# Altium project ES6339.PrjPcb
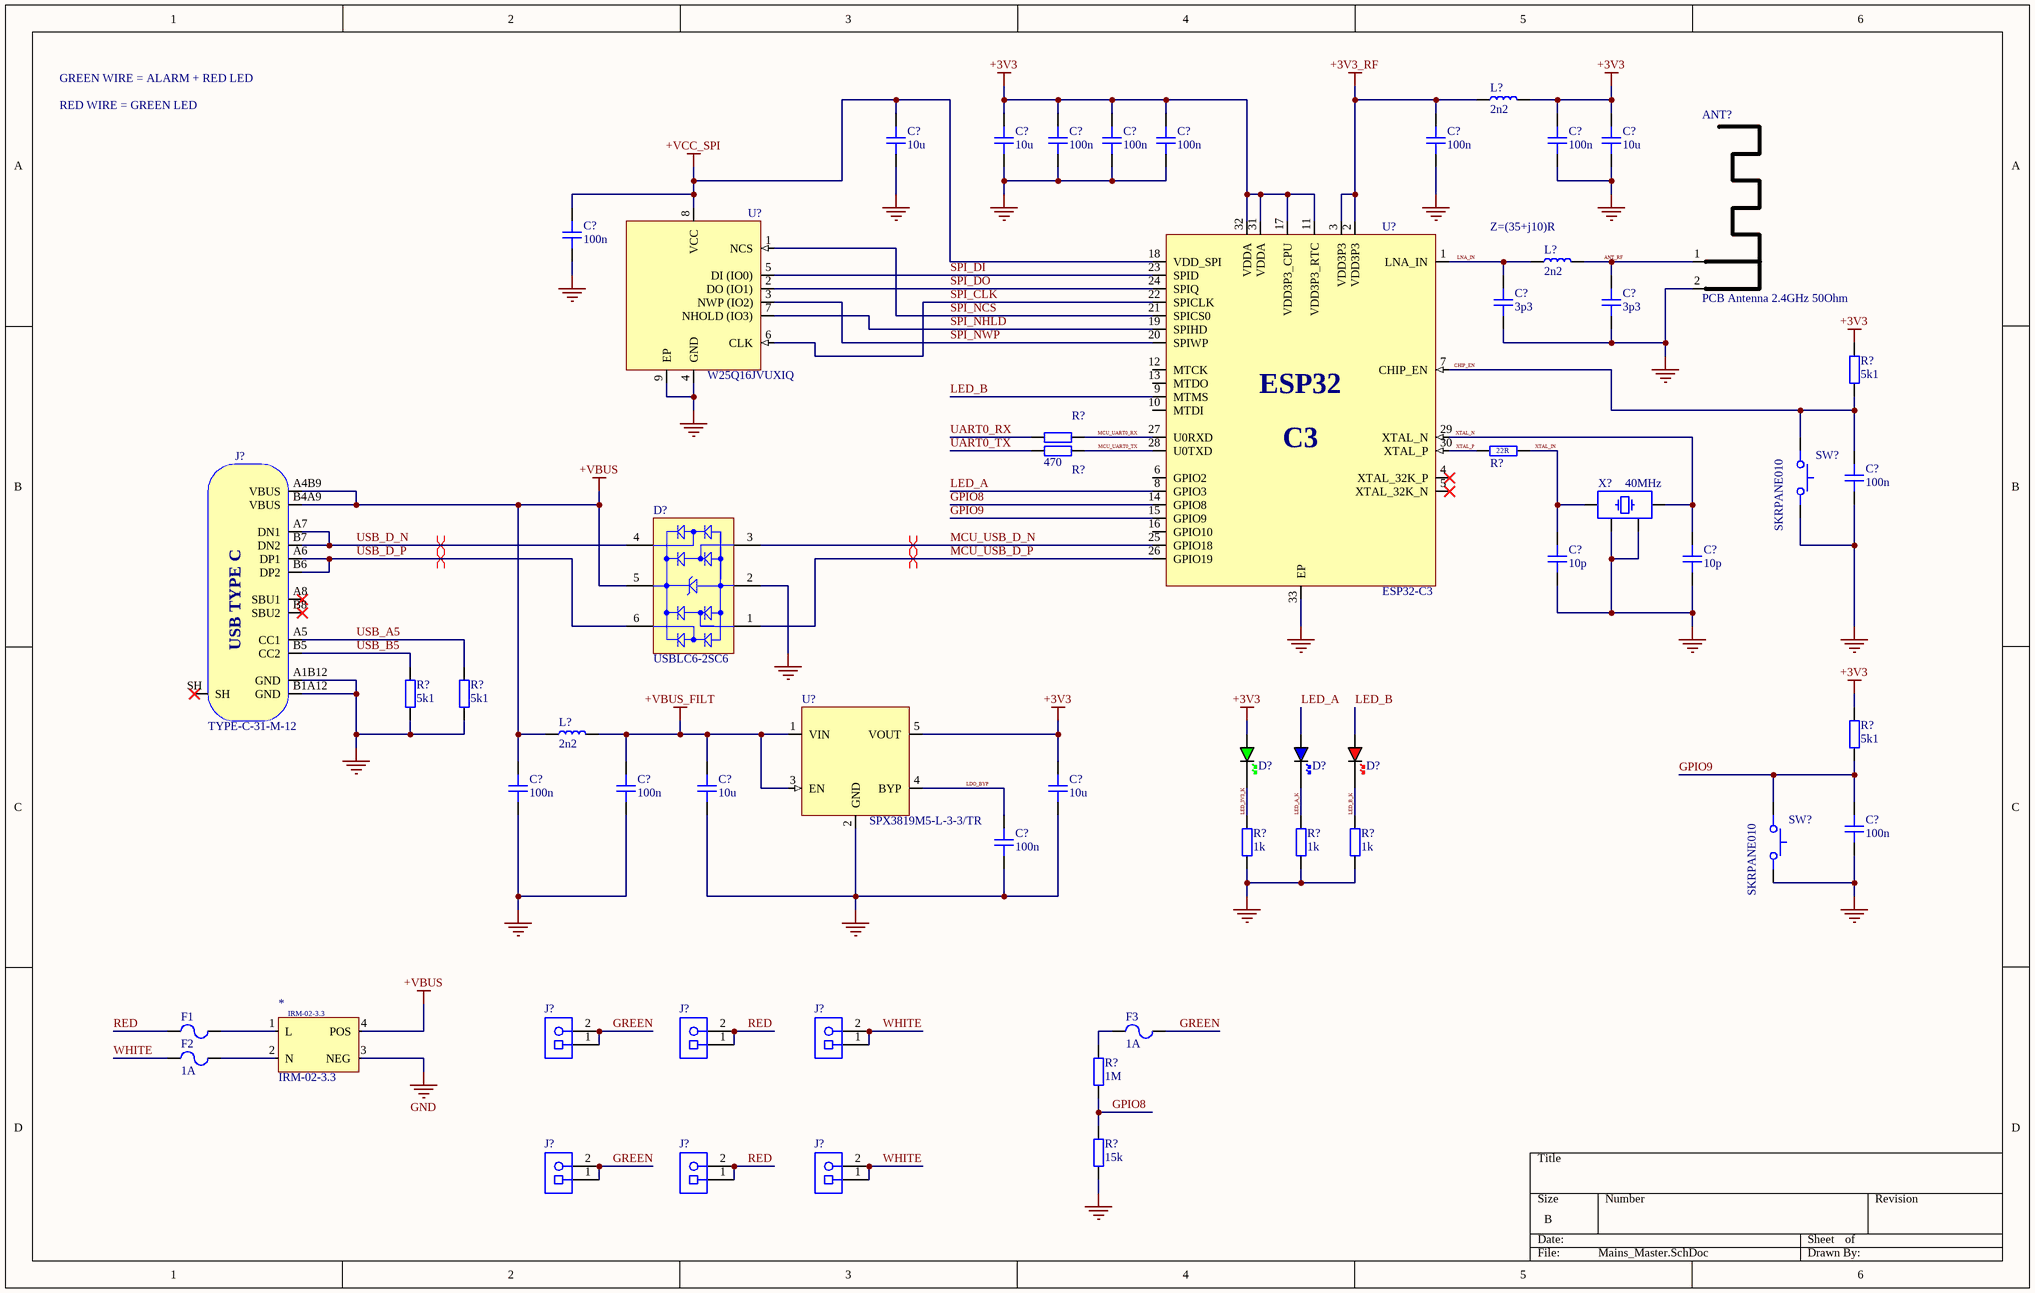
[diagram p0: Mains_Master.SchDoc]
2 sheets, 130 parts. Net scope: global (net labels, ports and power ports of the same name join across sheets).
Sheets:
  Mains_Master.SchDoc
  Door_Receiver.SchDoc

## Sheet Mains_Master.SchDoc
size B; SheetNumber: 1; SheetTotal: 2

### Parts
(Parts that share a designator on the sheet are numbered #1, #2 ... from top to bottom, then left to right.)
*  IRM-02-3.3  [IRM-02-3.3]
ANT?#1  PCB Antenna 2.4GHz 50Ohm  [ANT_IFA_USB_2_4GHZ_50R]  (no BOM)
C?#1  10u  [CAP_0603]
C?#2  10u  [CAP_0603]
C?#3  100n  [CAP_0805]
C?#4  100n  [CAP_0805]
C?#5  100n  [CAP_0805]
C?#6  100n  [CAP_0805]
C?#7  100n  [CAP_0805]
C?#8  10u  [CAP_0603]
C?#9  100n  [CAP_0805]
C?#10  3p3  [CAP_0402]
C?#11  3p3  [CAP_0402]
C?#12  100n  [CAP_0805]
C?#13  10p  [CAP_0402]
C?#14  10p  [CAP_0402]
C?#15  100n  [CAP_0805]
C?#16  100n  [CAP_0805]
C?#17  10u  [CAP_0603]
C?#18  10u  [CAP_0603]
C?#19  100n  [CAP_0805]
C?#20  100n  [CAP_0805]
D?#1  USBLC6-2SC6  [STM-SOT23-6L_V]
D?#2  GREEN  [LED_0603_GREEN]  (value not drawn)
D?#3  BLUE  [LED_0603_BLUE]  (value not drawn)
D?#4  RED  [LED_0603_RED]  (value not drawn)
F1  1A  [FUSE_6125N]  (value not drawn)
F2  1A  [FUSE_6125N]
F3  1A  [FUSE_6125N]
J?#1  TYPE-C-31-M-12  [TYPE-C-31-M-12]
J?#2  1729128  [PHOE-1729128-2_V]  (value not drawn)
J?#3  1729128  [PHOE-1729128-2_V]  (value not drawn)
J?#4  1729128  [PHOE-1729128-2_V]  (value not drawn)
J?#5  1729128  [PHOE-1729128-2_V]  (value not drawn)
J?#6  1729128  [PHOE-1729128-2_V]  (value not drawn)
J?#7  1729128  [PHOE-1729128-2_V]  (value not drawn)
L?#1  2n2  [IND_0402]
L?#2  2n2  [IND_0402]
L?#3  2n2  [IND_0402]
R?#1  5k1  [RES_0805]
R?#2  470  [RES_0805]  (value not drawn)
R?#3  470  [RES_0805]
R?#4  22R  [RES_0402]
R?#5  5k1  [RES_0805]
R?#6  5k1  [RES_0805]
R?#7  5k1  [RES_0805]
R?#8  1k  [RES_0805]
R?#9  1k  [RES_0805]
R?#10  1k  [RES_0805]
R?#11  1M  [RES_0805]
R?#12  15k  [RES_0805]
SW?#1  SKRPANE010  [SKRPANE010]
SW?#2  SKRPANE010  [SKRPANE010]
U?#1  W25Q16JVUXIQ  [USON-8-2X3MM]
U?#2  ESP32-C3  [QFN32-5x5]
U?#3  SPX3819M5-L-3-3/TR  [SOT-23-5]
X?#1  40MHz  [XTAL_2520]

### Nets
+3V3: C?#2.2 C?#3.2 C?#4.2 C?#5.2 C?#7.2 C?#8.2 C?#18.2 D?#2.A L?#1.1 R?#1.2 R?#7.2 U?#2.11(VDD3P3_RTC) U?#2.17(VDD3P3_CPU) U?#2.31(VDDA) U?#2.32(VDDA) U?#3.5(VOUT)
+3V3_RF: C?#6.2 L?#1.2 U?#2.2(VDD3P3) U?#2.3(VDD3P3)
+VBUS: *.4(POS) C?#15.2 D?#1.5(VBUS) J?#1.A4B9(VBUS) J?#1.B4A9(VBUS) L?#3.2
+VBUS_FILT: C?#16.2 C?#17.2 L?#3.1 U?#3.1(VIN) U?#3.3(EN)
+VCC_SPI: C?#1.2 C?#9.2 U?#1.8(VCC) U?#2.18(VDD_SPI)
GND: *.3(NEG) ANT?#1.2(GND) C?#1.1 C?#2.1 C?#3.1 C?#4.1 C?#5.1 C?#6.1 C?#7.1 C?#8.1 C?#9.1 C?#10.1 C?#11.1 C?#12.1 C?#13.1 C?#14.1 C?#15.1 C?#16.1 C?#17.1 C?#18.1 C?#19.1 C?#20.1 D?#1.2(GND) J?#1.A1B12(GND) J?#1.B1A12(GND) R?#5.1 R?#6.1 R?#8.1 R?#9.1 R?#10.1 R?#12.1 SW?#1.12 SW?#2.12 U?#1.4(GND) U?#1.9(EP) U?#2.33(EP) U?#3.2(GND) X?#1.2 X?#1.4
ANT_RF: ANT?#1.1(RF) C?#11.2 L?#2.1
CHIP_EN: C?#12.2 R?#1.1 SW?#1.34 U?#2.7(CHIP_EN)
GPIO8: R?#11.1 R?#12.2 U?#2.14(GPIO8)
GPIO9: C?#19.2 R?#7.1 SW?#2.34 U?#2.15(GPIO9)
GREEN: F3.2 J?#2.1 J?#2.2 J?#5.1 J?#5.2
LDO_BYP: C?#20.2 U?#3.4(BYP)
LED_3V3_K: D?#2.K R?#8.2
LED_A: D?#3.A U?#2.8(GPIO3)
LED_A_K: D?#3.K R?#9.2
LED_B: D?#4.A U?#2.9(MTMS)
LED_B_K: D?#4.K R?#10.2
LNA_IN: C?#10.2 L?#2.2 U?#2.1(LNA_IN)
MCU_UART0_RX: R?#2.1 U?#2.27(U0RXD)
MCU_UART0_TX: R?#3.1 U?#2.28(U0TXD)
MCU_USB_D_N: D?#1.3(I/O_2) U?#2.25(GPIO18)
MCU_USB_D_P: D?#1.1(I/O_1) U?#2.26(GPIO19)
RED: F1.1 J?#3.1 J?#3.2 J?#6.1 J?#6.2
SPI_CLK: U?#1.6(CLK) U?#2.22(SPICLK)
SPI_DI: U?#1.5(DI_(IO0)) U?#2.23(SPID)
SPI_DO: U?#1.2(DO_(IO1)) U?#2.24(SPIQ)
SPI_NCS: U?#1.1(NCS) U?#2.21(SPICS0)
SPI_NHLD: U?#1.7(NHOLD_(IO3)) U?#2.19(SPIHD)
SPI_NWP: U?#1.3(NWP_(IO2)) U?#2.20(SPIWP)
UART0_RX: R?#2.2
UART0_TX: R?#3.2
USB_A5: J?#1.A5(CC1) R?#6.2
USB_B5: J?#1.B5(CC2) R?#5.2
USB_D_N: D?#1.4(I/O_3) J?#1.A7(DN1) J?#1.B7(DN2)
USB_D_P: D?#1.6(I/O_4) J?#1.A6(DP1) J?#1.B6(DP2)
WHITE: F2.1 J?#4.1 J?#4.2 J?#7.1 J?#7.2
XTAL_IN: C?#13.2 R?#4.2 X?#1.3
XTAL_N: C?#14.2 U?#2.29(XTAL_N) X?#1.1
XTAL_P: R?#4.1 U?#2.30(XTAL_P)
Net*_1: *.1(L) F1.2
Net*_2: *.2(N) F2.2
NetF3_1: F3.1 R?#11.2

Not connected (* = marked no-connect by the designer): J?#1 A8(SBU1)* B8(SBU2)* SH*; U?#2 4(XTAL_32K_P)* 5(XTAL_32K_N)* 6(GPIO2) 10(MTDI) 12(MTCK) 13(MTDO) 16(GPIO10)

### Layout directives
differential pair; differential pair class DIFF_USB: MCU_USB_D_N, MCU_USB_D_P, USB_D_N, USB_D_P

### Notes on the sheet
- GREEN WIRE = ALARM + RED LED
- RED WIRE = GREEN LED
- (near L?#2) Z=(35+j10)R
- (in symbol ESP32-C3) ESP32; C3
- (in symbol TYPE-C-31-M-12) USB TYPE C

### Library data of the parts
ANT?#1 = ANT_IFA_USB_2_4GHZ_50R: Inverted F 2.4GHz ISM PCB Antenna 50 Ohm; ComponentLink1Description: Datasheet; ComponentLink1URL: https://www.ti.com/lit/an/swra117d/swra117d.pdf
C?#1 C?#2 C?#8 C?#17 C?#18 = CAP_0603_10V: Capacitor SMD 0603 10V; Manufacturer: Samsung; Manufacturer Part Number: CL10A106KP8NNNC; LCSC: C19702
C?#3-C?#7 C?#9 C?#12 C?#15 C?#16 C?#19 C?#20 = CAP_0805_50V: Capacitor SMD 0805 50V
C?#10 C?#11 = CAP_0402_50V: Capacitor SMD 0402 50V; Manufacturer: FH; Manufacturer Part Number: 0402CG3R3C500NT; LCSC: C1565
C?#13 C?#14 = CAP_0402_50V: Capacitor SMD 0402 50V; Manufacturer: Samsung; Manufacturer Part Number: CL05C100JB5NNNC; LCSC: C32949
D?#1 = CMP-2000-05378-1: Very low capacitance ESD protection, 3.5 pF, -40 to 125 degC, 6-Pin SOT23, RoHS, Tape and Reel; Manufacturer: STMicroelectronics; Polarity: Uni-Directional; Clamping Voltage: 17V; Rad Hardened: No; Product Height (mm): 1.3mm; Leakage Current (Max): 0.15uA; Product Length (mm): 3.05mm; Number of Elements: 1; Peak Pulse Current: 5A; Configuration: Dual; Reverse Breakdown Voltage: 6V; Working Voltage (Max): 5V; Capacitance Value: 3.5pF; Suppressor Type: DiodeArrays; Product Depth (mm): 1.75mm; Test Current (It): 1mA; Package / Case: SOT-23; Operating Temperature Max Deg. C: 125C; Package Description: 6-Pin Small Outline Transistor, Body 2.925 x 1.625 mm, Pitch 0.95 mm; Package Reference: SOT23-6L; Datasheet Version: Rev. 5, 10/2011; Operating Temperature Min Deg. C: -40C; Mounting Style: SurfaceMount; Direction Type: Uni-Directional; Mounting: SurfaceMount; Pin Count: 6; Leakage Current: 0.15uA; Packaging: TapeandReel; Operating Temperature Classification: Automotive; Clamping Voltage (Max): 17V; Manufacturer URL: http://www.st.com/; Reverse Stand-off Voltage: 5V; Datasheet URL: http://www.st.com/st-web-ui/static/active/en/resource/technical/document/datasheet/CD00050750.pdf; Working Voltage: 5V; Operating Temp Range: -40Cto125C; LCSC: C7519
D?#2 = LED_0603_GREEN: LED 0603 GREEN SMD; LCSC: C72043
D?#3 = LED_0603_BLUE: LED 0603 BLUE SMD
D?#4 = LED_0603_RED: LED 0603 RED SMD
F1-F3 = FUSE_4A_SMT: 0422001.MR; Manufacturer: Bel; Manufacturer P/N: SST4; Current Rating: 4A; Voltage Rating (AC): 125V; DC Cold Resistance: 24mR; Fuse Type: Board Mount (Cartridge Style Excluded); Approvals: CSA,CE,cULus; Supplier 1: Digi-Key; Supplier Part Number 1: 507-1070-1-ND; Mount: Surface Mount; Case/Package: SMD/SMT; Number of Pins: 2; Min Operating Temperature: -55°C; Max Operating Temperature: 125°C; Voltage Rating (DC): 125V; Length: 0.24inch; Height: 0.1inch; Width: 0.1inch; Lead Free: Lead Free; ComponentLink1URL: https://belfuse.com/resources/StewartConnector/SST.pdf?src-supplier=Digi-Key; ComponentLink1Description: https://belfuse.com/resources/StewartConnector/SST.pdf?src-supplier=Digi-Key
J?#1 = TYPE-C-31-M-12: USB Type C Connector Horizontal SMT; Manufacturer: Koren Hroparts; Manufacturer Part Number: TYPE-C-31-M-12; LCSC: C165948
J?#2-J?#7 = CMP-2000-05815-1: PCB Terminal Block, 13.5 A, 400 V, 2-Pin THD, RoHS, Bulk; Manufacturer: Phoenix Contact; Package Version: 03/2015; No. of Rows: 1; Pitch: 5.08mm; No. of Positions: 2; Voltage Rating: 400V; Current Rating: 13500mA; Connector Type: Screw; Current: 10A; Voltage: 300V; Max Current Rating: 13.5A; Test Voltage: 4kV; Wire Gauge (Max): 26AWG; Wire Gauge (Min): 14AWG; Approvals: UL,CSA; Manufacturer URL: http://www.phoenixcontact.com/; Datasheet URL: https://datasheet.ciiva.com/16046/1729128-16046181.pdf; RoHS: TRUE; Package URL: https://www.phoenixcontact.com/online/portal/pi/pxc/product_detail_page/!ut/p/b1/3VdJjqNKFDxLH8AFycySyWY2ozFsEPOMMQaDOX1XedGL_1Vdm5YXJleknhSKeBkvI6EA8ncAo3AYoDhBQGco6KN7VURTdemj9us_IEKEZo_YHiPAEWEFmDGOHMORkqKYCORBZxgL7ZoaZYcbFFUZ3fqxSY6GOuxydWUuHqz1ynmMFygu583Bob0Ewr6Sd_l-5m-kAueHiB0jpRwZwe58wwtkpxtMYd_LmGcDRU02dRNEyWt6Y2ti5pSyJ_reIkzIulrqApdnbT11V5jnCKbYNCvhEM1MCpPByat_X379-iThf08CI5GfOPqfBeS3BRoBOdD55AKVv0iLwCMq-2BrzXWSGRH7pUGD9uwXQjiph3xL0DKQwdGa0JImiIOmBNOestqgwTHSSs2oOep-78apyXQBvNi8ZLaFjvjWvcaUEBu0MC6Wbe-d6mB0FAebo2lUWinqYaZs5DAYzV0RP9yitUjnGJ0iI9xhZkT42OCQNUJJhkgWINNQLP2JFP6OpMg3JCVg70jqHT0lvKOnhHf0lPuOnnLf0VPuWx6_dxwUIvwk5WMkT0kLL1mh61l2yZVSzG3pYV_bqo-mj6uMKwKwdnnW8Jh5RTOJzMOA5c-eJDaZQw4mTMPH02PvS_ZAqNVjVTo2WyYLkwH_KU1mmmG5kjRhDqPXLwwVHvVOjCM60-fpXvTDfMGW1PVFVS1r4e4yVDk4ZdNbkUHvqPqQSeian4UD39fNKmachqdJ1NJbyk8rXT9mXTvPk3oE5meulKGgiruPJek-4I9hTT6G8ZLOyRSm2RRVbThERQad5OS28hdt4YW4vG0stgYYzsWsK4_7y6DZMjJSCqri1kyiZR5vD7pwIrNR7QwPHTcLTI5qT7eRlpHrdGiupYlqQDJ7zy_CND8fWWBoLRXxk1RVcXiBQwbTD4Xi7KL-FuO94t9xaqweXzH; PartNumber: 1729128; Package Description: 2-Pin Through Hole Device, Body 8.1 x 10.16 mm, Pitch 5.08 mm; Datasheet Version: 12/2013; Mounting Technology: ThroughHole; Orientation: Horizontal; Package Reference: 1729128-2; Packing: Bulk; Supplier 1: Digi-Key; Manufacturer Part Number: 1729128; Category: Terminal Blocks; Stock 1: 30124; Pricing 1: 1=1.09000, 10=1.04700, 50=1.00100, 100=0.97370, 250=0.91000, 500=0.83720, 1000=0.77350, 2500=0.73710, 5000=0.69160 (USD); Mount: Through Hole; Number of Pins: 2; Color: Green; Housing Color: Green; Housing Material: Polyamide; Contact Material: Tin; Weight: 0.069842oz; Insulation Material: Nylon; Min Operating Temperature: -20°C; Max Operating Temperature: 100°C; Packaging: Bulk; Termination: Solder; Number of Positions: 2; Number of Poles: 2; Package Quantity: 50; Number of Contacts: 2; Series: MKDSN; Number of Rows: 1; Number of Levels: 1; Number of Positions Per Level: 2; Max Supply Voltage: 400V; Number of Circuits: 2; Length: 8.1mm; Width: 13.5mm; Height: 13.5mm; Depth: 8.1mm; Wire/Cable Gauge: 26AWG; Radiation Hardening: No; REACH SVHC: No SVHC; Flammability Rating: UL94 V-0; RoHS Compliant: Yes; Lead Free: Lead Free; ComponentLink1URL: https://datasheet.ciiva.com/823/1729128-823779.pdf?src-supplier=Digi-Key; ComponentLink1Description: https://datasheet.ciiva.com/823/1729128-823779.pdf?src-supplier=Digi-Key; ComponentLink2URL: https://datasheet.ciiva.com/15169/getdatasheetpartid-199310-15169845.pdf?src-supplier=Verical; ComponentLink2Description: https://datasheet.ciiva.com/15169/getdatasheetpartid-199310-15169845.pdf?src-supplier=Verical; ComponentLink3URL: https://datasheet.ciiva.com/16046/1729128-16046181.pdf?src-supplier=Onlinecomponents.com; ComponentLink3Description: https://datasheet.ciiva.com/16046/1729128-16046181.pdf?src-supplier=Onlinecomponents.com; ComponentLink4URL: https://datasheet.ciiva.com/14607/70054405-14607157.pdf?src-supplier=Allied+Electronics; ComponentLink4Description: https://datasheet.ciiva.com/14607/70054405-14607157.pdf?src-supplier=Allied+Electronics; ComponentLink5URL: https://datasheet.ciiva.com/29218/743664-da-01-en-printklemmenblock-mkdsn-1-5-2-5-08-29218154.pdf?src-supplier=Conrad; ComponentLink5Description: https://datasheet.ciiva.com/29218/743664-da-01-en-printklemmenblock-mkdsn-1-5-2-5-08-29218154.pdf?src-supplier=Conrad
L?#1-L?#3 = IND_0402: Inductor SMD 0402; Manufacturer: Murata; Manufacturer Part Number: LQW15AN2N2G80D; LCSC: C412264
R?#1-R?#3 R?#5-R?#12 = RES_0805: Resistor SMD 0805; Manufacturer: *; Manufacturer Part Number: *; Distributor Link: *
R?#4 = RES_0402: Resistor SMD 0402; Manufacturer: UNI-ROYAL; Manufacturer Part Number: 0402WGF220JTCE; LCSC: C25092
SW?#1 SW?#2 = SKRPANE010: Tactile Switch SMD SPST; Manufacturer: Alps Alpine; Manufacturer Part Number: SKRPANE010; LCSC: C470426
U?#1 = W25Q16JVUXIQ: 16M-BIT SERIAL FLASH MEMORY WITH / DUAL/QUAD SPI USON-8; Manufacturer: Winbond; Manufacturer Part Number: W25Q16JVUXIQ; LCSC: C2843335
U?#2 = ESP32-C3: Ultra­Low­Power SoC with RISC­V Single­Core CPU Supporting IEEE 802.11b/g/n (2.4 GHz Wi­Fi) and Bluetooth® 5 (LE); Manufacturer: Espressif; Manufacturer Part Number: ESP32-C3; LCSC: C2838500
U?#3 = SPX3819M5-L-3-3/TR: 500mA +3.3V Low-Noise LDO Voltage Regulator; Manufacturer: MaxLinear; Manufacturer Part Number: SPX3819M5-L-3-3/TR; LCSC: C9055
X?#1 = XTAL_2520: Crystal SMD 2520; Manufacturer: Seiko Epson; Manufacturer Number: Q24FA20H0020900; Frequency: 40MHz; LCSC: C255973

## Sheet Door_Receiver.SchDoc
size B; SheetNumber: 2; SheetTotal: 2
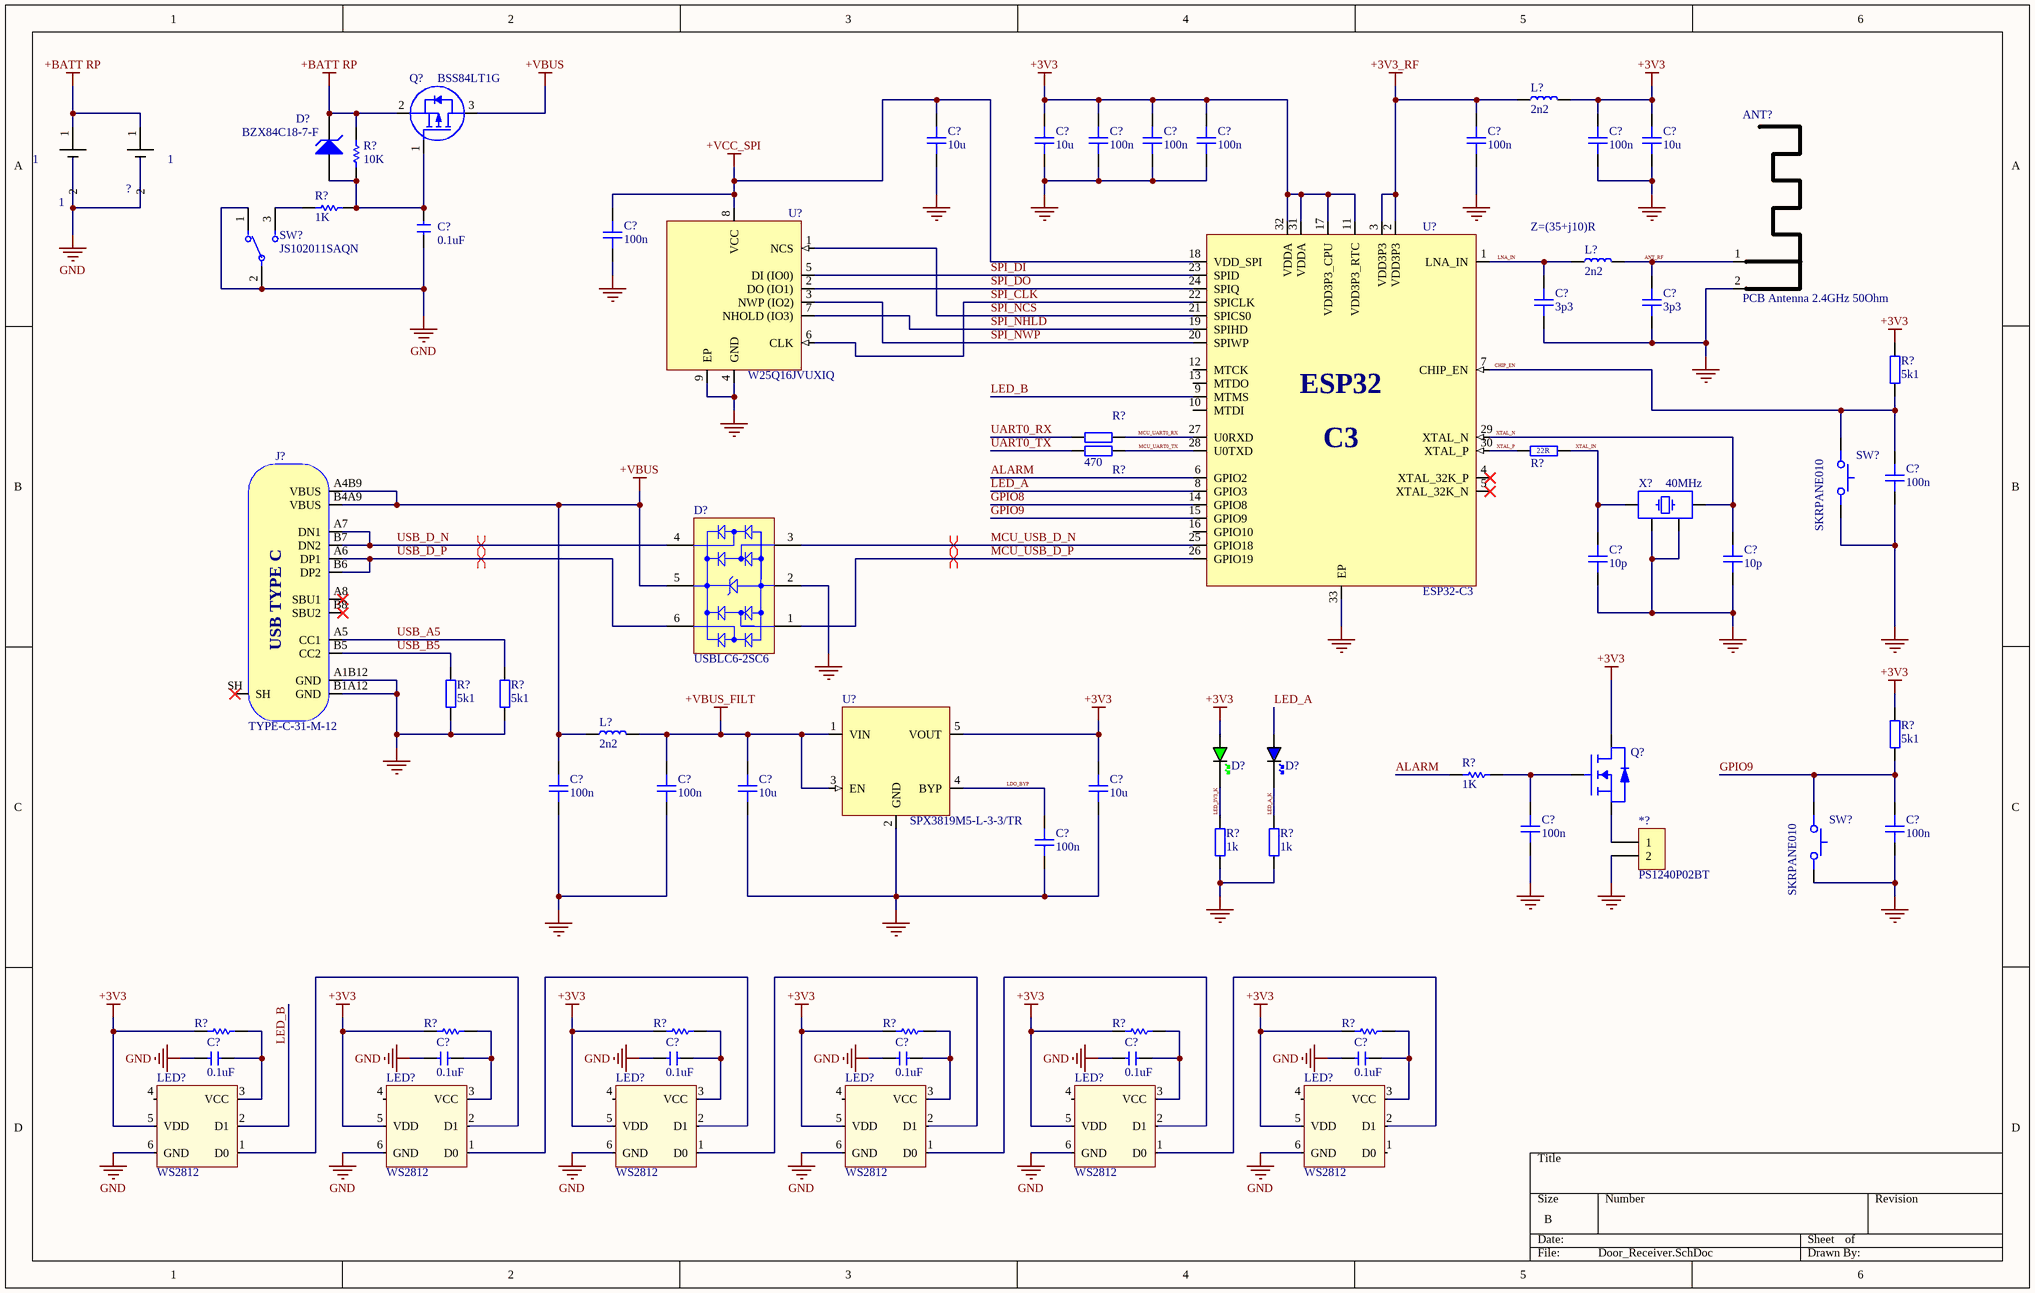
[diagram p1: Door_Receiver.SchDoc]

### Parts
(Parts that share a designator on the sheet are numbered #1, #2 ... from top to bottom, then left to right.)
1  1  [X001KMQ2V9]
*?  PS1240P02BT  [PS1240P02BT]
?  1  [X001KMQ2V9]
ANT?#2  PCB Antenna 2.4GHz 50Ohm  [ANT_IFA_USB_2_4GHZ_50R]  (no BOM)
C?#21  10u  [CAP_0603]
C?#22  10u  [CAP_0603]
C?#23  100n  [CAP_0805]
C?#24  100n  [CAP_0805]
C?#25  100n  [CAP_0805]
C?#26  100n  [CAP_0805]
C?#27  100n  [CAP_0805]
C?#28  10u  [CAP_0603]
C?#29  100n  [CAP_0805]
C?#30  0.1uF  [CAPC2012N]
C?#31  3p3  [CAP_0402]
C?#32  3p3  [CAP_0402]
C?#33  100n  [CAP_0805]
C?#34  10p  [CAP_0402]
C?#35  10p  [CAP_0402]
C?#36  100n  [CAP_0805]
C?#37  100n  [CAP_0805]
C?#38  10u  [CAP_0603]
C?#39  10u  [CAP_0603]
C?#40  100n  [CAP_0805]
C?#41  100n  [CAP_0805]
C?#42  100n  [CAP_0805]
C?#43  0.1uF  [CAPC2012N]
C?#44  0.1uF  [CAPC2012N]
C?#45  0.1uF  [CAPC2012N]
C?#46  0.1uF  [CAPC2012N]
C?#47  0.1uF  [CAPC2012N]
C?#48  0.1uF  [CAPC2012N]
D?#5  Manufacturer P/N: BZX84C18-7-F  [SOT23]  (hidden comment: Diode, Zener, BZX84C18)
D?#6  USBLC6-2SC6  [STM-SOT23-6L_V]
D?#7  GREEN  [LED_0603_GREEN]  (value not drawn)
D?#8  BLUE  [LED_0603_BLUE]  (value not drawn)
J?#8  TYPE-C-31-M-12  [TYPE-C-31-M-12]
L?#4  2n2  [IND_0402]
L?#5  2n2  [IND_0402]
L?#6  2n2  [IND_0402]
LED?#1  WS2812  [WS2812]
LED?#2  WS2812  [WS2812]
LED?#3  WS2812  [WS2812]
LED?#4  WS2812  [WS2812]
LED?#5  WS2812  [WS2812]
LED?#6  WS2812  [WS2812]
Q?#1  BSS84LT1G  [SOT23]
Q?#2  SSM3K72KCT,L3F  [CST3-SOT-883]  (value not drawn)
R?#13  10K  [RESC2012N]
R?#14  Resistance (Ohms): 1K  [RESC2012N]  (hidden comment: Res_1.0K_0805)
R?#15  5k1  [RES_0805]
R?#16  470  [RES_0805]  (value not drawn)
R?#17  470  [RES_0805]
R?#18  22R  [RES_0402]
R?#19  5k1  [RES_0805]
R?#20  5k1  [RES_0805]
R?#21  5k1  [RES_0805]
R?#22  Resistance (Ohms): 1K  [RESC2012N]  (hidden comment: Res_1.0K_0805)
R?#23  1k  [RES_0805]
R?#24  1k  [RES_0805]
R?#25  150  [RESC2012N]  (value not drawn)
R?#26  150  [RESC2012N]  (value not drawn)
R?#27  150  [RESC2012N]  (value not drawn)
R?#28  150  [RESC2012N]  (value not drawn)
R?#29  150  [RESC2012N]  (value not drawn)
R?#30  150  [RESC2012N]  (value not drawn)
SW?#3  JS102011SAQN  [FP-JS102011SAQN-MFG]
SW?#4  SKRPANE010  [SKRPANE010]
SW?#5  SKRPANE010  [SKRPANE010]
U?#4  W25Q16JVUXIQ  [USON-8-2X3MM]
U?#5  ESP32-C3  [QFN32-5x5]
U?#6  SPX3819M5-L-3-3/TR  [SOT-23-5]
X?#2  40MHz  [XTAL_2520]

### Nets
+3V3: C?#22.2 C?#23.2 C?#24.2 C?#25.2 C?#27.2 C?#28.2 C?#39.2 D?#7.A L?#4.1 LED?#1.5(VDD) LED?#2.5(VDD) LED?#3.5(VDD) LED?#4.5(VDD) LED?#5.5(VDD) LED?#6.5(VDD) Q?#2.D R?#15.2 R?#21.2 R?#25.1 R?#26.1 R?#27.1 R?#28.1 R?#29.1 R?#30.1 U?#5.11(VDD3P3_RTC) U?#5.17(VDD3P3_CPU) U?#5.31(VDDA) U?#5.32(VDDA) U?#6.5(VOUT)
+3V3_RF: C?#26.2 L?#4.2 U?#5.2(VDD3P3) U?#5.3(VDD3P3)
+BATT RP: 1.1 ?.1 D?#5.3(K) Q?#1.2 R?#13.2
+VBUS: C?#36.2 D?#6.5(VBUS) J?#8.A4B9(VBUS) J?#8.B4A9(VBUS) L?#6.2 Q?#1.3
+VBUS_FILT: C?#37.2 C?#38.2 L?#6.1 U?#6.1(VIN) U?#6.3(EN)
+VCC_SPI: C?#21.2 C?#29.2 U?#4.8(VCC) U?#5.18(VDD_SPI)
GND: 1.2 *?.2 ?.2 ANT?#2.2(GND) C?#21.1 C?#22.1 C?#23.1 C?#24.1 C?#25.1 C?#26.1 C?#27.1 C?#28.1 C?#29.1 C?#30.1 C?#31.1 C?#32.1 C?#33.1 C?#34.1 C?#35.1 C?#36.1 C?#37.1 C?#38.1 C?#39.1 C?#40.1 C?#41.1 C?#42.1 C?#43.1 C?#44.1 C?#45.1 C?#46.1 C?#47.1 C?#48.1 D?#6.2(GND) J?#8.A1B12(GND) J?#8.B1A12(GND) LED?#1.6(GND) LED?#2.6(GND) LED?#3.6(GND) LED?#4.6(GND) LED?#5.6(GND) LED?#6.6(GND) R?#19.1 R?#20.1 R?#23.1 R?#24.1 SW?#3.1 SW?#3.2(C) SW?#4.12 SW?#5.12 U?#4.4(GND) U?#4.9(EP) U?#5.33(EP) U?#6.2(GND) X?#2.2 X?#2.4
ALARM: R?#22.1 U?#5.6(GPIO2)
ANT_RF: ANT?#2.1(RF) C?#32.2 L?#5.1
CHIP_EN: C?#33.2 R?#15.1 SW?#4.34 U?#5.7(CHIP_EN)
GPIO8: U?#5.14(GPIO8)
GPIO9: C?#41.2 R?#21.1 SW?#5.34 U?#5.15(GPIO9)
LDO_BYP: C?#42.2 U?#6.4(BYP)
LED_3V3_K: D?#7.K R?#23.2
LED_A: D?#8.A U?#5.8(GPIO3)
LED_A_K: D?#8.K R?#24.2
LED_B: LED?#1.2(D1) U?#5.9(MTMS)
LNA_IN: C?#31.2 L?#5.2 U?#5.1(LNA_IN)
MCU_UART0_RX: R?#16.1 U?#5.27(U0RXD)
MCU_UART0_TX: R?#17.1 U?#5.28(U0TXD)
MCU_USB_D_N: D?#6.3(I/O_2) U?#5.25(GPIO18)
MCU_USB_D_P: D?#6.1(I/O_1) U?#5.26(GPIO19)
SPI_CLK: U?#4.6(CLK) U?#5.22(SPICLK)
SPI_DI: U?#4.5(DI_(IO0)) U?#5.23(SPID)
SPI_DO: U?#4.2(DO_(IO1)) U?#5.24(SPIQ)
SPI_NCS: U?#4.1(NCS) U?#5.21(SPICS0)
SPI_NHLD: U?#4.7(NHOLD_(IO3)) U?#5.19(SPIHD)
SPI_NWP: U?#4.3(NWP_(IO2)) U?#5.20(SPIWP)
UART0_RX: R?#16.2
UART0_TX: R?#17.2
USB_A5: J?#8.A5(CC1) R?#20.2
USB_B5: J?#8.B5(CC2) R?#19.2
USB_D_N: D?#6.4(I/O_3) J?#8.A7(DN1) J?#8.B7(DN2)
USB_D_P: D?#6.6(I/O_4) J?#8.A6(DP1) J?#8.B6(DP2)
XTAL_IN: C?#34.2 R?#18.2 X?#2.3
XTAL_N: C?#35.2 U?#5.29(XTAL_N) X?#2.1
XTAL_P: R?#18.1 U?#5.30(XTAL_P)
Net*?_1: *?.1 Q?#2.S
NetC?#30_2: C?#30.2 D?#5.1(A) Q?#1.1 R?#13.1 R?#14.2
NetC?#40_2: C?#40.2 Q?#2.G R?#22.2
NetC?#43_2: C?#43.2 LED?#1.3(VCC) R?#25.2
NetC?#44_2: C?#44.2 LED?#2.3(VCC) R?#26.2
NetC?#45_2: C?#45.2 LED?#3.3(VCC) R?#27.2
NetC?#46_2: C?#46.2 LED?#4.3(VCC) R?#28.2
NetC?#47_2: C?#47.2 LED?#5.3(VCC) R?#29.2
NetC?#48_2: C?#48.2 LED?#6.3(VCC) R?#30.2
NetLED?#1_1: LED?#1.1(D0) LED?#2.2(D1)
NetLED?#2_1: LED?#2.1(D0) LED?#3.2(D1)
NetLED?#3_1: LED?#3.1(D0) LED?#4.2(D1)
NetLED?#4_1: LED?#4.1(D0) LED?#5.2(D1)
NetLED?#5_1: LED?#5.1(D0) LED?#6.2(D1)
NetR?#14_1: R?#14.1 SW?#3.3

Not connected (* = marked no-connect by the designer): J?#8 A8(SBU1)* B8(SBU2)* SH*; LED?#1 4(_); LED?#2 4(_); LED?#3 4(_); LED?#4 4(_); LED?#5 4(_); LED?#6 1(D0) 4(_); U?#5 4(XTAL_32K_P)* 5(XTAL_32K_N)* 10(MTDI) 12(MTCK) 13(MTDO) 16(GPIO10)

### Layout directives
differential pair; differential pair class DIFF_USB: MCU_USB_D_N, MCU_USB_D_P, USB_D_N, USB_D_P

### Notes on the sheet
- (near L?#5) Z=(35+j10)R
- (in symbol ESP32-C3) ESP32; C3
- (in symbol TYPE-C-31-M-12) USB TYPE C

### Library data of the parts
1 ? = X001KMQ2V9
*? = PS1240P02BT: Buzzer, Piezo, 3V, 12.2mm
ANT?#2 = ANT_IFA_USB_2_4GHZ_50R: Inverted F 2.4GHz ISM PCB Antenna 50 Ohm; ComponentLink1Description: Datasheet; ComponentLink1URL: https://www.ti.com/lit/an/swra117d/swra117d.pdf
C?#21 C?#22 C?#28 C?#38 C?#39 = CAP_0603_10V: as C?#1 on sheet Mains_Master; LCSC: C19702
C?#23-C?#27 C?#29 C?#33 C?#36 C?#37 C?#40-C?#42 = CAP_0805_50V: Capacitor SMD 0805 50V
C?#30 C?#43-C?#48 = Cap_0.1uF_50V_0805: CAP CER 0.1UF 50V; Manufacturer: KEMET; Manufacturer P/N: C0805C104M5RACAUTO; Dielectric Material: Ceramic; Tolerance: 20%; Dielectric: X7R; Capacitance: 100nF; Supplier 1: Digi-Key; Supplier Part Number 1: 399-12977-1-ND; Mount: Surface Mount; Case/Package: 0805; Case Code (Metric): 2012; Case Code (Imperial): 0805; Contact Plating: Matte,Tin; Min Operating Temperature: -55°C; Max Operating Temperature: 125°C; Voltage Rating: 50V; Voltage Rating (DC): 50V; Termination: Wraparound; Length: 2mm; Width: 0.049inch; Thickness: 0.035inch; Depth: 1.25mm; Ratings: AEC-Q200; REACH SVHC: No SVHC
C?#31 C?#32 = CAP_0402_50V: as C?#10 on sheet Mains_Master; LCSC: C1565
C?#34 C?#35 = CAP_0402_50V: as C?#13 on sheet Mains_Master; LCSC: C32949
D?#5 = Diode_BZX84C18: DIODE ZENER 18V 300mW SOT23; Manufacturer: Diodes; Max Power Dissipation: 350mW; Max Reverse Leakage Current: 100nA; Tolerance: 6%; Zener Current: 5mA; Output Current: 18mA; Supplier 1: Digi-Key; Supplier Part Number 1: BZX84C18-FDICT-ND; Case/Package: SOT-23; Number of Pins: 3; Min Operating Temperature: -65°C; Max Operating Temperature: 150°C; Zener Voltage: 18V; Voltage Tolerance: 6%; Working Voltage: 18V; Peak Reverse Current: 100nA; Test Current: 5mA; Power Rating: 350mW; Voltage Rating (DC): 18V; Lead Free: Lead Free; ComponentLink1Description: https://www.diodes.com/assets/Datasheets/ds18001.pdf
D?#6 = CMP-2000-05378-1: as D?#1 on sheet Mains_Master; Package / Case: SOT-23; Operating Temperature Max Deg. C: 125C; Package Description: 6-Pin Small Outline Transistor, Body 2.925 x 1.625 mm, Pitch 0.95 mm; Package Reference: SOT23-6L; Datasheet Version: Rev. 5, 10/2011; Operating Temperature Min Deg. C: -40C; Mounting Style: SurfaceMount; Direction Type: Uni-Directional; Mounting: SurfaceMount; Pin Count: 6; Leakage Current: 0.15uA; Packaging: TapeandReel; Operating Temperature Classification: Automotive; Clamping Voltage (Max): 17V; Manufacturer URL: http://www.st.com/; Reverse Stand-off Voltage: 5V; Datasheet URL: http://www.st.com/st-web-ui/static/active/en/resource/technical/document/datasheet/CD00050750.pdf; Working Voltage: 5V; Operating Temp Range: -40Cto125C; LCSC: C7519
D?#7 = LED_0603_GREEN: LED 0603 GREEN SMD; LCSC: C72043
D?#8 = LED_0603_BLUE: LED 0603 BLUE SMD
J?#8 = TYPE-C-31-M-12: as J?#1 on sheet Mains_Master; Manufacturer Part Number: TYPE-C-31-M-12; LCSC: C165948
L?#4-L?#6 = IND_0402: as L?#1 on sheet Mains_Master; LCSC: C412264
Q?#1 = BSS84LT1G: MOSFET P-CH 50V 130mA SOT-23; Manufacturer: ON Semiconductor; Manufacturer P/N: BSS84LT1-G; Rise Time: 1ns; Rds On Max: 10R; Input Capacitance: 30pF; Max Power Dissipation: 225mW; Turn-Off Delay Time: 16ns; Turn-On Delay Time: 3.6ns; Gate to Source Voltage (Vgs): 20V; Nominal Vgs: 2V; Threshold Voltage: -2V; Element Configuration: Single; Voltage Rating (DC): -50V; Current Rating: -130mA; Supplier 1: Digi-Key; Supplier Part Number 1: BSS84LT1GOSCT-ND; Case/Package: SOT-23-3; Number of Pins: 3; Contact Plating: Matte,Tin; Min Operating Temperature: -55°C; Max Operating Temperature: 150°C; Drain to Source Voltage (Vdss): 50V; Continuous Drain Current (ID): 130mA; Fall Time: 1ns; Power Dissipation: 225mW; Drain to Source Breakdown Voltage: 50V; Drain to Source Resistance: 10R; On-State Resistance: 10R; Radiation Hardening: No; Lead Free: Lead Free; REACH SVHC: No SVHC; Halogen Free: Halogen Free; ComponentLink3URL: http://www.onsemi.com/pub/Collateral/BSS84LT1-D.PDF; ComponentLink3Description: Datasheet
Q?#2 = SSM3K72KCT,L3F: MOSFET N-Channel Vds=60V Id=400mA Rds(on)=1.05R with ESD Protection; Manufacturer: Toshiba; Manufacturer Part Number: SSM3K72KCT,L3F; Distributor Link: https://www.mouser.de/ProductDetail/Toshiba/SSM3K72KCTL3F?qs=PDgMCp4xDJZBSQ%2Fqg29QOw%3D%3D
R?#13 = Res_10K_0805: RES 10K OHM 1/8W 1% 0805; Manufacturer: Vishay; Manufacturer P/N: CRCW080510K0FKEA; Resistance: 10kR; Power Rating: 125mW; Voltage Rating: 150V; Temperature Coefficient: 100ppm/°C; Supplier 1: Digi-Key; Supplier Part Number 1: 541-10.0KCCT-ND; Case/Package: 0805; Weight: 0.000194oz; Case Code (Imperial): 0805; Case Code (Metric): 2012; Contact Plating: Tin; Min Operating Temperature: -55°C; Max Operating Temperature: 155°C; Tolerance: 1%; Package Quantity: 5000; Composition: Thick Film; Military Standard: Not; Termination: SMD/SMT; Voltage Rating (DC): 150V; Length: 2mm; Height: 0.45mm; Width: 1.25mm; Depth: 1.25mm; Radiation Hardening: No; REACH SVHC: Unknown; Lead Free: Lead Free; ComponentLink4URL: http://www.vishay.com/docs/20035/dcrcwe3.pdf; ComponentLink4Description: http://www.vishay.com/docs/20035/dcrcwe3.pdf
R?#14 R?#22 = Res_1.0K_0805: RES 1.0K OHM 1/8W 1% 0805; Manufacturer P/N: RC0805FR-071KL; Manufacturer: Yageo; Power (Watts): 0.125W, 1/8W; Temperature Coefficient: ±100ppm/°C; Supplier 1: Digi-Key; Supplier Part Number 1: 311-1.00KCRCT-ND; RoHS: RoHS Compliant; Composition: Thick Film; Tolerance: ±1%; Package / Case: 0805 (2012 Metric); ComponentLink1URL: http://www.yageo.com/documents/recent/PYu-RC0805_51_RoHS_L_5.pdf; ComponentLink1Description: Datasheet; Supplier 2: Digi-Key; Supplier Part Number 2: 311-1.00KCRTR-ND
R?#15-R?#17 R?#19-R?#21 R?#23 R?#24 = RES_0805: Resistor SMD 0805; Manufacturer: *; Manufacturer Part Number: *; Distributor Link: *
R?#18 = RES_0402: as R?#4 on sheet Mains_Master; LCSC: C25092
R?#25-R?#30 = Res_150_0805: RES 150 OHM 1/8W 1% 0805; Manufacturer: Vishay; Manufacturer P/N: CRCW0805150RFKEA; Power Rating: 125mW; Resistance: 150R; Voltage Rating: 150V; Temperature Coefficient: 100ppm/°C; Supplier 1: Digi-Key; Supplier Part Number 1: 541-150CCT-ND; Mount: Surface Mount; Case/Package: 0805; Weight: 0.000194oz; Case Code (Metric): 2012; Case Code (Imperial): 0805; Contact Plating: Tin; Min Operating Temperature: -55°C; Max Operating Temperature: 155°C; Tolerance: 1%; Package Quantity: 10; Composition: Thick Film; Termination: SMD/SMT; Max Power Dissipation: 125mW; Voltage Rating (DC): 150V; Features: Automotive AEC-Q200; Military Standard: Not; Length: 2mm; Height: 0.45mm; Width: 0.049inch; Depth: 1.25mm; Radiation Hardening: No; Lead Free: Lead Free; REACH SVHC: Unknown; ComponentLink3URL: http://www.vishay.com/docs/20035/dcrcwe3.pdf; ComponentLink3Description: http://www.vishay.com/docs/20035/dcrcwe3.pdf
SW?#3 = CMP-2000-06501-2: SWITCH SLIDE SPDT 300MA 6V; Switch Function: On-On; Illumination Type: Non-Illuminated; Switch Travel: 2mm; Contact Resistance: 70mR; Actuator Material: Nylon; Electrical Life: 5000Cycles; Actuator Type: Standard; Max Operating Temperature: 85°C; Housing Material: Nylon; Radiation Hardening: No; Max Voltage Rating (DC): 6V; Package Quantity: 1; Case/Package: 100; Actuator Length: 2mm; Min Operating Temperature: -40°C; Contact Current Rating: 300mA; REACH SVHC: No SVHC; Throw Configuration: SPDT; Packaging: Tape and Reel; Contact Material: Copper Alloy; Max Current Rating: 300mA; Current Rating: 300mA; Mount: Surface Mount; Lead Free: Lead Free; Termination: Gull Wing; Voltage Rating (DC): 6V; Length: 9mm; Orientation: Right Angle; Contact Plating: Silver
SW?#4 SW?#5 = SKRPANE010: as SW?#1 on sheet Mains_Master; Manufacturer Part Number: SKRPANE010; LCSC: C470426
U?#4 = W25Q16JVUXIQ: as U?#1 on sheet Mains_Master; Manufacturer Part Number: W25Q16JVUXIQ; LCSC: C2843335
U?#5 = ESP32-C3: as U?#2 on sheet Mains_Master; Manufacturer Part Number: ESP32-C3; LCSC: C2838500
U?#6 = SPX3819M5-L-3-3/TR: as U?#3 on sheet Mains_Master; Manufacturer Part Number: SPX3819M5-L-3-3/TR; LCSC: C9055
X?#2 = XTAL_2520: as X?#1 on sheet Mains_Master; Frequency: 40MHz; LCSC: C255973

## Nets that join several sheets
+3V3: Mains_Master (16 pins), Door_Receiver (29 pins)
+3V3_RF: Mains_Master (C?#6.2 L?#1.2 U?#2.2 U?#2.3), Door_Receiver (C?#26.2 L?#4.2 U?#5.2 U?#5.3)
+VBUS: Mains_Master (6 pins), Door_Receiver (6 pins)
+VBUS_FILT: Mains_Master (5 pins), Door_Receiver (5 pins)
+VCC_SPI: Mains_Master (C?#1.2 C?#9.2 U?#1.8 U?#2.18), Door_Receiver (C?#21.2 C?#29.2 U?#4.8 U?#5.18)
GND: Mains_Master (39 pins), Door_Receiver (55 pins)
ANT_RF: Mains_Master (ANT?#1.1 C?#11.2 L?#2.1), Door_Receiver (ANT?#2.1 C?#32.2 L?#5.1)
CHIP_EN: Mains_Master (C?#12.2 R?#1.1 SW?#1.34 U?#2.7), Door_Receiver (C?#33.2 R?#15.1 SW?#4.34 U?#5.7)
GPIO8: Mains_Master (R?#11.1 R?#12.2 U?#2.14), Door_Receiver (U?#5.14)
GPIO9: Mains_Master (C?#19.2 R?#7.1 SW?#2.34 U?#2.15), Door_Receiver (C?#41.2 R?#21.1 SW?#5.34 U?#5.15)
LDO_BYP: Mains_Master (C?#20.2 U?#3.4), Door_Receiver (C?#42.2 U?#6.4)
LED_3V3_K: Mains_Master (D?#2.K R?#8.2), Door_Receiver (D?#7.K R?#23.2)
LED_A: Mains_Master (D?#3.A U?#2.8), Door_Receiver (D?#8.A U?#5.8)
LED_A_K: Mains_Master (D?#3.K R?#9.2), Door_Receiver (D?#8.K R?#24.2)
LED_B: Mains_Master (D?#4.A U?#2.9), Door_Receiver (LED?#1.2 U?#5.9)
LNA_IN: Mains_Master (C?#10.2 L?#2.2 U?#2.1), Door_Receiver (C?#31.2 L?#5.2 U?#5.1)
MCU_UART0_RX: Mains_Master (R?#2.1 U?#2.27), Door_Receiver (R?#16.1 U?#5.27)
MCU_UART0_TX: Mains_Master (R?#3.1 U?#2.28), Door_Receiver (R?#17.1 U?#5.28)
MCU_USB_D_N: Mains_Master (D?#1.3 U?#2.25), Door_Receiver (D?#6.3 U?#5.25)
MCU_USB_D_P: Mains_Master (D?#1.1 U?#2.26), Door_Receiver (D?#6.1 U?#5.26)
SPI_CLK: Mains_Master (U?#1.6 U?#2.22), Door_Receiver (U?#4.6 U?#5.22)
SPI_DI: Mains_Master (U?#1.5 U?#2.23), Door_Receiver (U?#4.5 U?#5.23)
SPI_DO: Mains_Master (U?#1.2 U?#2.24), Door_Receiver (U?#4.2 U?#5.24)
SPI_NCS: Mains_Master (U?#1.1 U?#2.21), Door_Receiver (U?#4.1 U?#5.21)
SPI_NHLD: Mains_Master (U?#1.7 U?#2.19), Door_Receiver (U?#4.7 U?#5.19)
SPI_NWP: Mains_Master (U?#1.3 U?#2.20), Door_Receiver (U?#4.3 U?#5.20)
UART0_RX: Mains_Master (R?#2.2), Door_Receiver (R?#16.2)
UART0_TX: Mains_Master (R?#3.2), Door_Receiver (R?#17.2)
USB_A5: Mains_Master (J?#1.A5 R?#6.2), Door_Receiver (J?#8.A5 R?#20.2)
USB_B5: Mains_Master (J?#1.B5 R?#5.2), Door_Receiver (J?#8.B5 R?#19.2)
USB_D_N: Mains_Master (D?#1.4 J?#1.A7 J?#1.B7), Door_Receiver (D?#6.4 J?#8.A7 J?#8.B7)
USB_D_P: Mains_Master (D?#1.6 J?#1.A6 J?#1.B6), Door_Receiver (D?#6.6 J?#8.A6 J?#8.B6)
XTAL_IN: Mains_Master (C?#13.2 R?#4.2 X?#1.3), Door_Receiver (C?#34.2 R?#18.2 X?#2.3)
XTAL_N: Mains_Master (C?#14.2 U?#2.29 X?#1.1), Door_Receiver (C?#35.2 U?#5.29 X?#2.1)
XTAL_P: Mains_Master (R?#4.1 U?#2.30), Door_Receiver (R?#18.1 U?#5.30)